# EAGLE design psu (EAGLE 7.4.0)
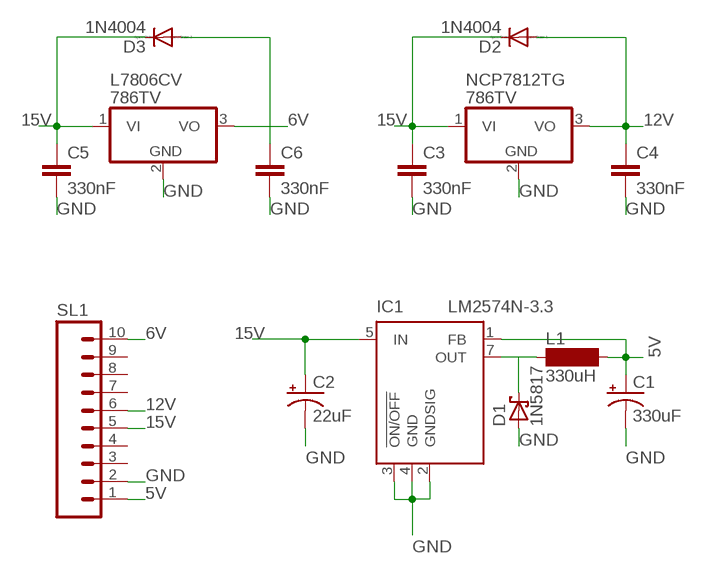
[diagram p0: schematic, sheet 1]

## Parts
C1  330uF  CPOL-USE5-8.5  [E5-8,5]
C2  22uF  CPOL-USE5-5  [E5-5]
C3  330nF  C-EU050-030X075  [C050-030X075]
C4  330nF  C-EU050-030X075  [C050-030X075]
C5  330nF  C-EU050-030X075  [C050-030X075]
C6  330nF  C-EU050-030X075  [C050-030X075]
D1  1N5817  BYV10  [DO41-10]
D2  1N4004  [DO41-10]
D3  1N4004  [DO41-10]
IC1  LM2574N-3.3  [DIL08]
L1  330uH  BS11  [BS11]
L7806CV  786TV  [TO220V]
NCP7812TG  786TV  [TO220V]
SL1  M10  [10P]

## Nets
5V: C1.+ IC1.1(FB) L1.2 SL1.1
6V: C6.1 D3.A L7806CV.3(VO) SL1.10
12V: C4.1 D2.A NCP7812TG.3(VO) SL1.6
15V: C2.+ C3.1 C5.1 D2.C D3.C IC1.5(IN) L7806CV.1(VI) NCP7812TG.1(VI) SL1.5
GND: C1.- C2.- C3.2 C4.2 C5.2 C6.2 D1.A IC1.2(GNDSIG) IC1.3(!ON/OFF) IC1.4(GND) L7806CV.2(GND) NCP7812TG.2(GND) SL1.2
LM_OUT: D1.C IC1.7(OUT) L1.1
Unconnected: SL1.3 SL1.4 SL1.7 SL1.8 SL1.9

## Library data of the parts
C1 C2 = rcl:CPOL-US: POLARIZED CAPACITOR, American symbol
C3-C6 = rcl:C-EU: CAPACITOR, European symbol
D1 = diode:BYV10: DIODE power diode
D2 D3 = diode:1N4004: DIODE general purpose rectifier, 1 A
IC1 = linear:LM2574?-*: SIMPLE SWITCHER 0.5A Step-Down Voltage Regulator Source: http://cache.national.com/ds/LM/LM2574.pdf
L1 = inductor-neosid:BS: INDUCTOR nominal inductance, magnetically screened; OC_FARNELL: unknown; OC_NEWARK: unknown
L7806CV NCP7812TG = linear:78*: Positive VOLTAGE REGULATOR Source: http://cache.national.com/ds/LM/LM78L05.pdf http://www.fairchildsemi.com/ds/LM/LM7805.pdf
SL1 = con-amp-quick:M10: AMP QUICK CONNECTOR; OC_FARNELL: unknown; OC_NEWARK: unknown

## Board
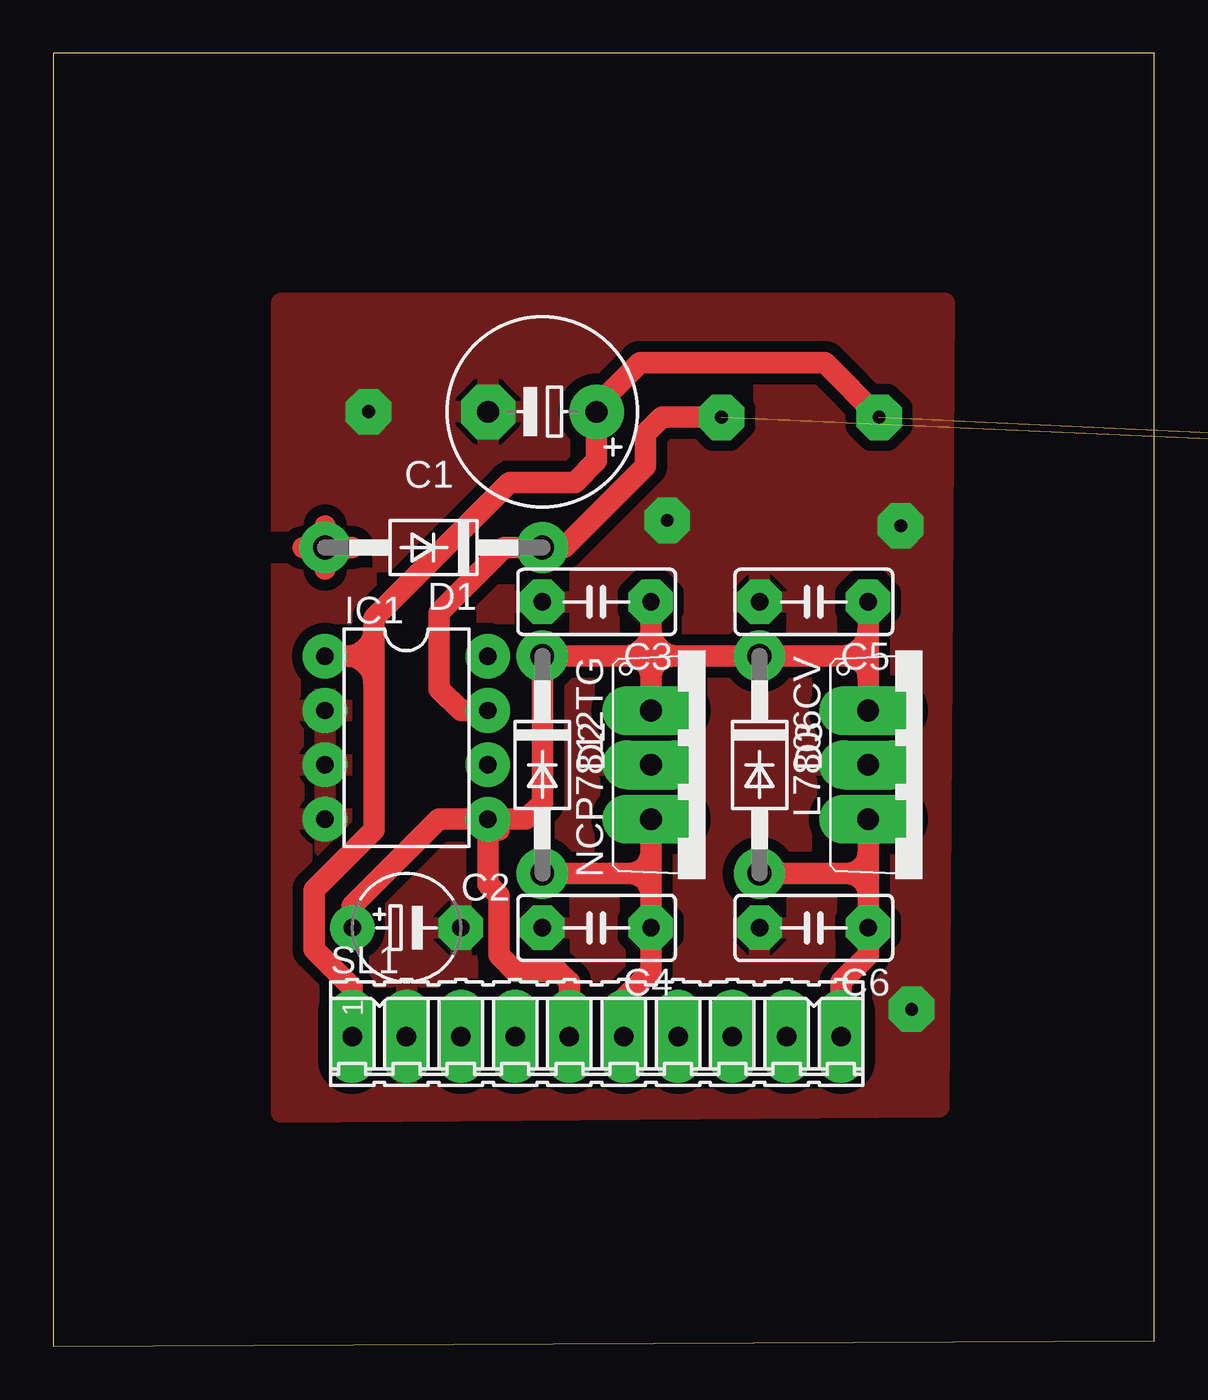
[diagram p1: board, top side]
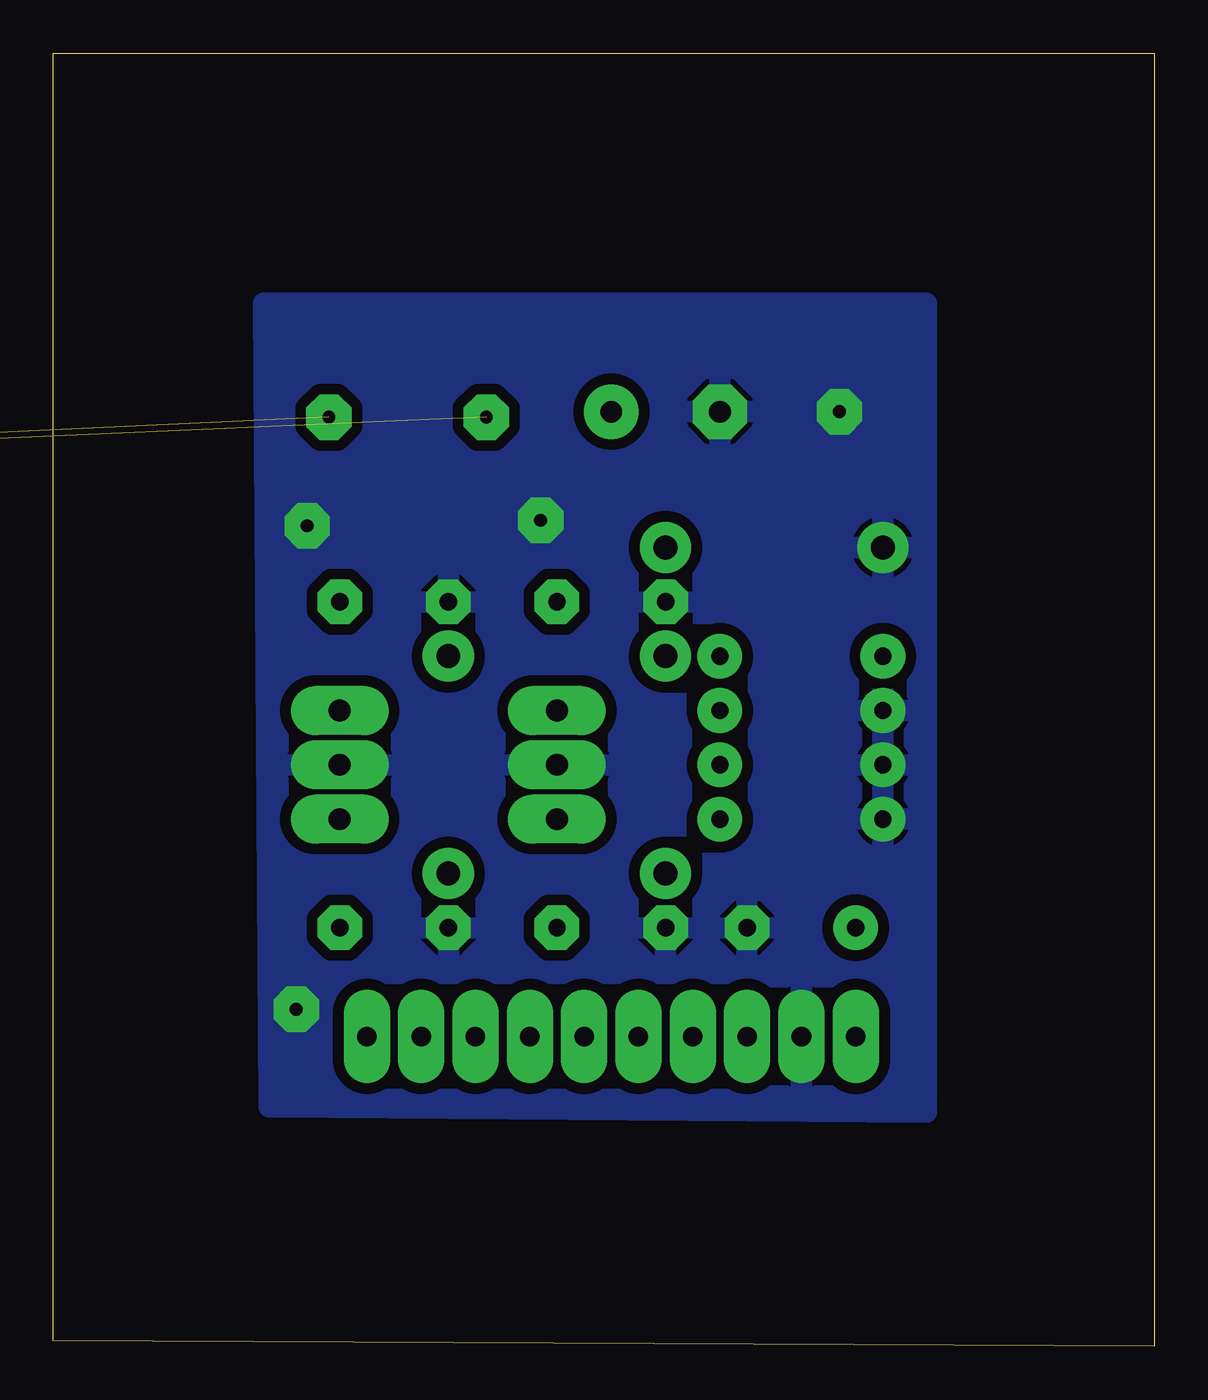
[diagram p2: board, bottom side, seen from below]

Size 51.49 x 60.44 mm. Coordinates in mm from the lower left corner, seen from the top.
Outline: 0,0 51.49,0.25 51.49,60.44 0,60.44 0,0
Copper layers (1*16): Top 0.035mm / dielectric 1.5mm / Bottom 0.035mm
Design rules "default *": minimum track width 10mil, minimum drill 24mil, track to track 20mil, track to pad 20mil, pad to pad 20mil, via to via 20mil, smd to smd 20mil, copper to edge 40mil, drill to drill 8mil, minimum pad ring 25mil, minimum via ring 30mil, stop-mask expansion 4mil, vias tented up to drill 0mil, thermal gap 10mil

### Footprints (pad centres in the part's own frame; a part is rotated, then mirrored left to right if it is on the bottom)
E5-8,5 = drill 1.016 pad 2.54: + -2.54,0 | drill 1.016 pad 2.54 octagon: - 2.54,0
E5-5 = drill 0.813 pad 1.905: + -2.54,0 | drill 0.813 pad 1.905 octagon: - 2.54,0
C050-030X075 = drill 0.813 octagon: 1 -2.54,0; 2 2.54,0
DO41-10 = drill 1.118: A 5.08,0; C -5.08,0
DIL08 = drill 0.813 pad 1.27: 1 -3.81,-3.81; 2 -1.27,-3.81; 3 1.27,-3.81; 4 3.81,-3.81; 5 3.81,3.81; 6 1.27,3.81; 7 -1.27,3.81; 8 -3.81,3.81
BS11 = drill 0.7 long: 1 -2.5,0; 2 2.5,0
TO220V = drill 1.016 long: 1 -2.54,-2.54; 2 0,-2.54; 3 2.54,-2.54
10P = drill 0.914 long: 1 -11.43,0; 2 -8.89,0; 3 -6.35,0; 4 -3.81,0; 5 -1.27,0; 6 1.27,0; 7 3.81,0; 8 6.35,0; 9 8.89,0; 10 11.43,0

### Placement (x,y rotation side)
C1  22.86,43.69 180 top
C2  16.51,19.56 0 top
C3  25.4,34.8 180 top
C4  25.4,19.56 180 top
C5  35.56,34.8 180 top
C6  35.56,19.56 180 top
D1  17.78,37.34 180 top
D2  22.86,27.18 270 top
D3  33.02,27.18 270 top
IC1  16.51,28.45 270 top
L1  74.17,41.66 0 top  (outside the outline)
L7806CV  40.64,27.18 270 top
NCP7812TG  30.48,27.18 270 top
SL1  25.4,14.48 0 top

### Tracks (layer width: path | path; a pad name or v marks a point on that pad's centre or on a via)
5V  (1 unrouted)
  Top 1.016: IC1.1 13.72,32.26 | 13.72,32.26 14.99,32.26 | SL1.1 13.97,16.76 12.19,18.54 12.19,21.34 14.99,24.13 14.99,30.99 | 14.99,30.99 14.99,32.26 | 14.99,32.26 14.99,33.53 | 14.99,33.53 14.99,34.04 21.34,40.39 24.38,40.39 25.4,41.4 C1.+ 25.4,43.94 27.43,45.97 36.07,45.97 38.61,43.43 | 13.72,32.26 arc90 14.99,33.53 | 13.72,32.26 arc-90 14.99,30.99
6V
  Top 1.016: D3.A 36.83,22.1 37.08,22.1 | 37.08,22.1 38.1,22.1 | 38.1,22.1 38.1,23.11 | 38.1,23.11 L7806CV.3 | 38.1,21.08 C6.1 38.1,18.29 36.83,17.02 SL1.10 | 38.1,21.08 38.1,22.1 | 38.1,23.11 arc-90 37.08,22.1 | 37.08,22.1 arc-90 38.1,21.08
12V
  Top 1.016: SL1.6 26.67,16.26 27.94,17.53 C4.1 27.94,21.08 | 27.94,21.08 27.94,21.84 | 27.94,21.84 27.94,23.11 | 27.94,23.11 NCP7812TG.3 | D2.A 26.67,22.1 26.92,22.1 | 26.92,22.1 27.69,22.1 27.94,21.84 | 27.94,23.11 arc-90 26.92,22.1 | 26.92,22.1 arc-90 27.94,21.08
15V
  Top 1.016: C2.+ 13.97,20.57 18.03,24.64 IC1.5 | SL1.5 24.13,17.02 23.62,17.53 21.59,17.53 20.83,18.29 20.83,21.08 20.32,21.59 IC1.5 | 20.83,24.13 IC1.5 | IC1.5 22.1,24.64 22.86,25.4 D2.C 26.67,32.26 | C3.1 27.94,33.53 | 27.94,33.53 27.94,33.02 | 27.94,33.02 27.94,32.26 | 27.94,32.26 27.94,31.24 | 27.94,31.24 NCP7812TG.1 | 36.83,32.26 D3.C 29.21,32.26 | 37.08,32.26 38.1,32.26 | 38.1,32.26 38.1,31.24 | 38.1,31.24 L7806CV.1 | 38.1,32.26 38.1,33.53 | 38.1,33.53 C5.1 | 26.92,32.26 27.94,32.26 | 29.21,32.26 28.96,32.26 | 28.7,32.26 27.94,32.26 | 27.94,33.02 arc90 28.7,32.26 | 28.7,32.26 28.96,32.26 | 28.96,32.26 arc90 27.94,31.24 | 27.94,31.24 arc90 26.92,32.26 | 26.92,32.26 26.67,32.26 | 26.67,32.26 arc90 27.94,33.53 | 27.94,33.53 arc90 29.21,32.26 | 38.1,33.53 arc-90 36.83,32.26 | 36.83,32.26 37.08,32.26 | 37.08,32.26 arc-90 38.1,31.24
GND  (via drill 0.6)
  other vias: 14.73,43.69 28.7,38.61 39.62,38.35 40.13,15.75
  pour Bottom: 10.67,10.92 41.4,11.18 41.66,48.77 10.67,48.77
  pour Top: 10.67,10.92 41.4,11.18 41.66,48.77 10.67,48.77
LM_OUT  (1 unrouted)
  Top 1.016: IC1.7 19.05,29.72 18.03,30.73 18.03,34.29 21.08,37.34 D1.C 23.88,37.34 27.69,41.15 27.69,42.67 28.45,43.43 31.24,43.43
N$1
  Top 1.016: 13.97,37.34 13.72,37.34 arc-90 12.7,38.35 arc-90 11.68,37.34 arc-90 12.7,36.32 12.7,36.58 arc-90 13.46,37.34
N$3  (via drill 0.6)
  other vias: 31.24,43.43
N$4  (via drill 0.6)
  other vias: 38.61,43.43